# Altium schematic sheet SCH.SchDoc
size A2
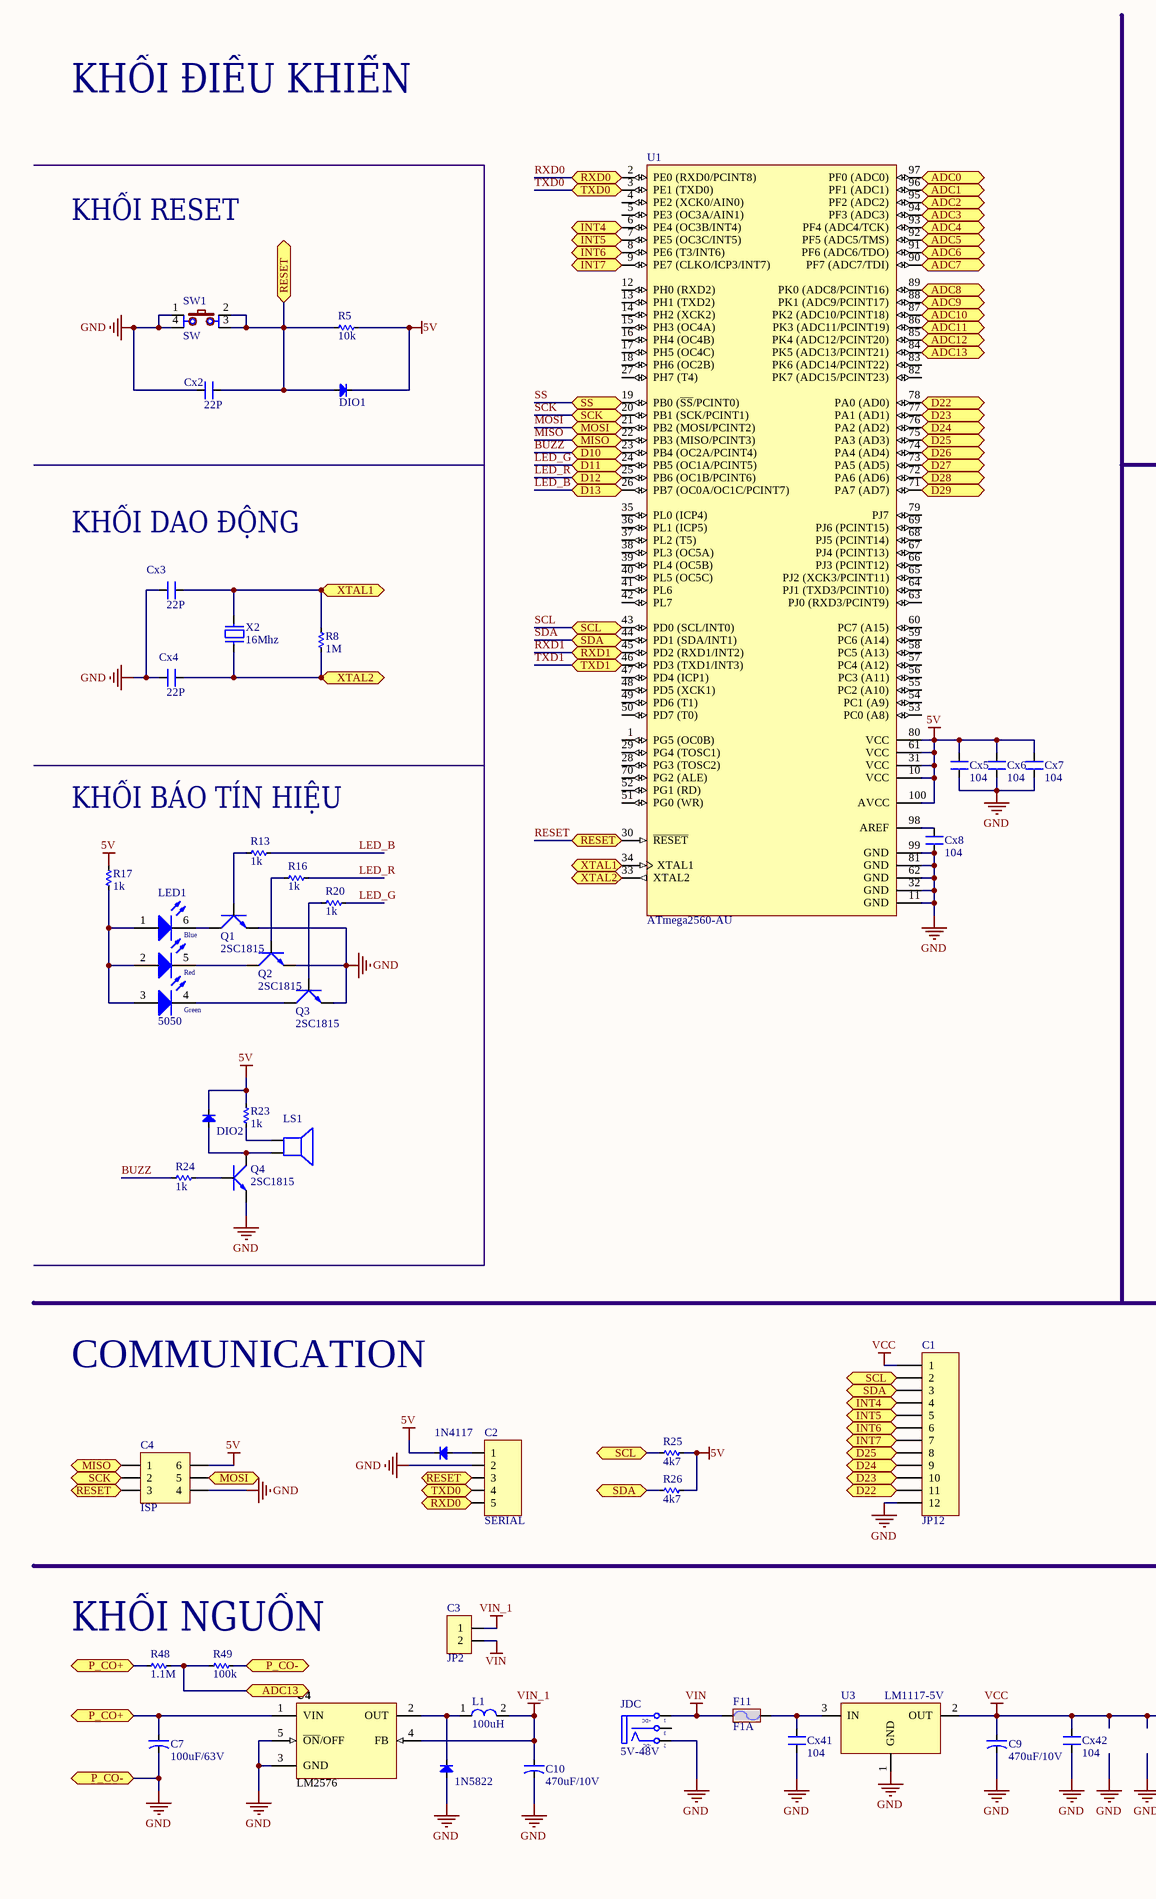
[diagram p0: SCH.SchDoc, left]
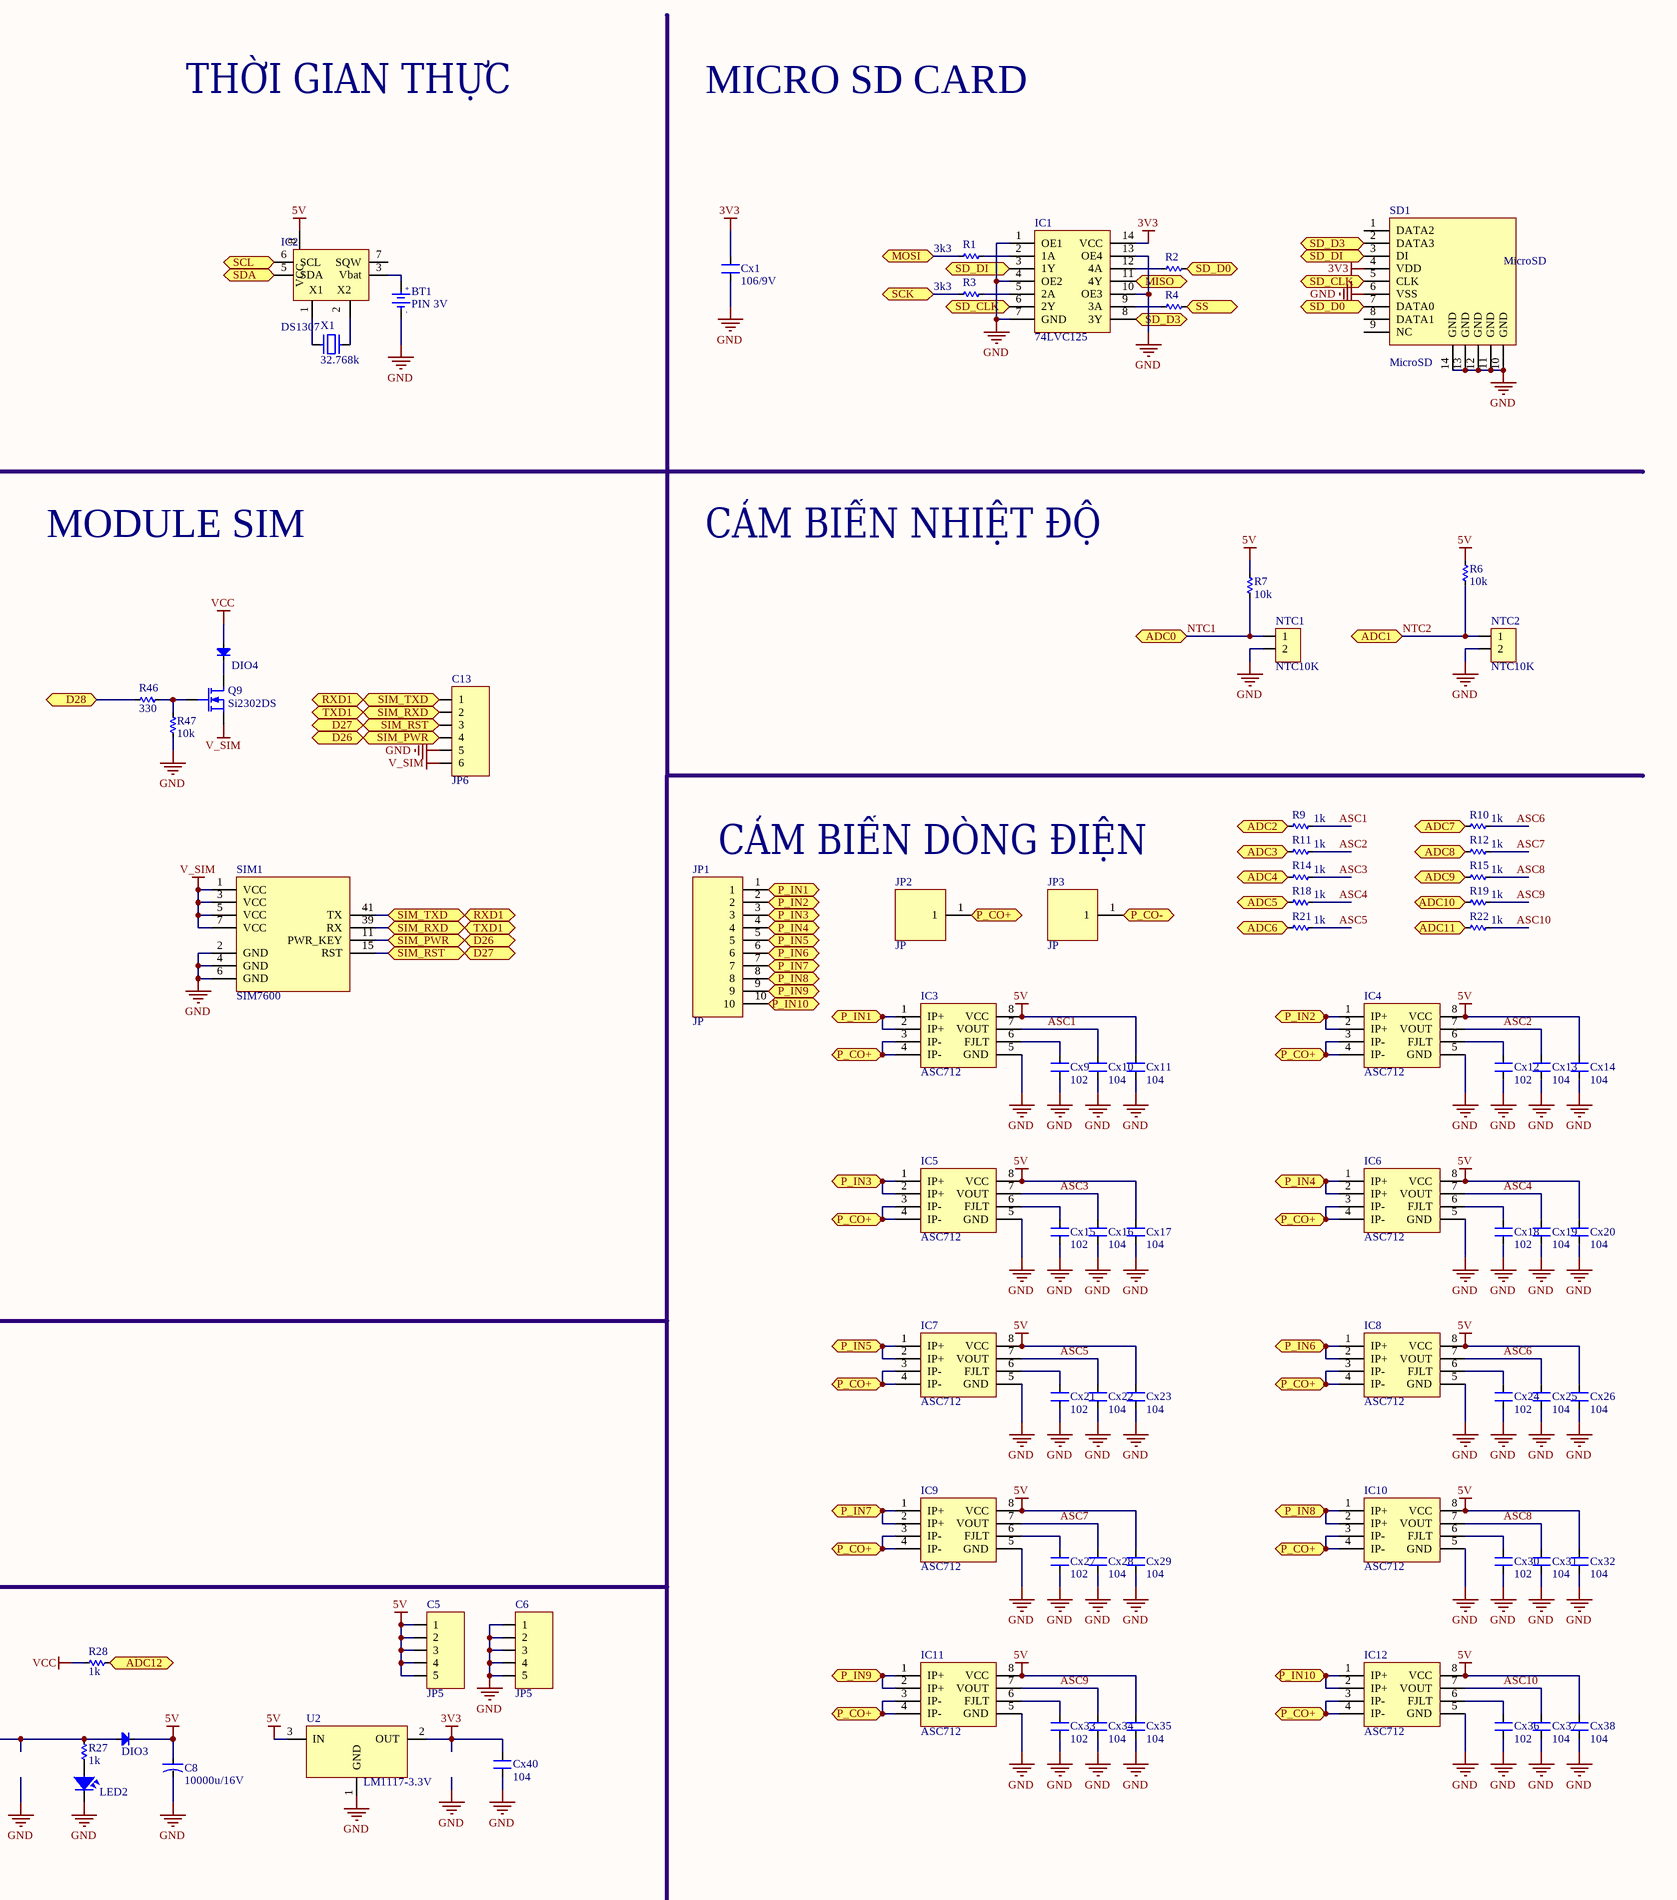
[diagram p1: SCH.SchDoc, right]

## Parts
1N4117  Diode SMD  [DIO-SMD-106]  (value not drawn)
1N5822  Diode SMD  [DIO-SMD-A]  (value not drawn)
BT1  PIN 3V  [PIN CR1220-DIP]
C1  JP12  [JP12-D1T]
C2  SERIAL  [JP5-D1T]
C3  JP2  [JP2-CLOSED]
C4  ISP  [JP3-D2T]
C5  JP5  [JP5-D1T]
C6  JP5  [JP5-D1T]
C7  100uF/63V  [CAP-ALU-SMD-C]
C8  10000u/16V  [CA-ALU-16]
C9  470uF/10V  [CAP-ALU-SMD-C]
C10  470uF/10V  [CAP-ALU-SMD-C]
C13  JP6  [JP6-C1T]
Cx1  106/9V  [CN-SMD-1206]
Cx2  22P  [CN-SMD-0805]
Cx3  22P  [CN-SMD-0805]
Cx4  22P  [CN-SMD-0805]
Cx5  104  [CN-SMD-0805]
Cx6  104  [CN-SMD-0805]
Cx7  104  [CN-SMD-0805]
Cx8  104  [CN-SMD-0805]
Cx9  102  [CN-SMD-0805]
Cx10  104  [CN-SMD-0805]
Cx11  104  [CN-SMD-0805]
Cx12  102  [CN-SMD-0805]
Cx13  104  [CN-SMD-0805]
Cx14  104  [CN-SMD-0805]
Cx15  102  [CN-SMD-0805]
Cx16  104  [CN-SMD-0805]
Cx17  104  [CN-SMD-0805]
Cx18  102  [CN-SMD-0805]
Cx19  104  [CN-SMD-0805]
Cx20  104  [CN-SMD-0805]
Cx21  102  [CN-SMD-0805]
Cx22  104  [CN-SMD-0805]
Cx23  104  [CN-SMD-0805]
Cx24  102  [CN-SMD-0805]
Cx25  104  [CN-SMD-0805]
Cx26  104  [CN-SMD-0805]
Cx27  102  [CN-SMD-0805]
Cx28  104  [CN-SMD-0805]
Cx29  104  [CN-SMD-0805]
Cx30  102  [CN-SMD-0805]
Cx31  104  [CN-SMD-0805]
Cx32  104  [CN-SMD-0805]
Cx33  102  [CN-SMD-0805]
Cx34  104  [CN-SMD-0805]
Cx35  104  [CN-SMD-0805]
Cx36  102  [CN-SMD-0805]
Cx37  104  [CN-SMD-0805]
Cx38  104  [CN-SMD-0805]
Cx40  104  [CN-SMD-0805]
Cx41  104  [CN-SMD-0805]
Cx42  104  [CN-SMD-0805]
DIO1  Diode SMD  [DIO-SMD-106]  (value not drawn)
DIO2  Diode SMD  [DIO-SMD-106]  (value not drawn)
DIO3  Diode SMD  [DIO-SMD-106]  (value not drawn)
DIO4  Diode SMD  [DIO-SMD-106]  (value not drawn)
F11  F1A  [Fuse5]
IC1  74LVC125  [74LVC125]
IC2  DS1307  [SO8]
IC3  ASC712  [ASC712]
IC4  ASC712  [ASC712]
IC5  ASC712  [ASC712]
IC6  ASC712  [ASC712]
IC7  ASC712  [ASC712]
IC8  ASC712  [ASC712]
IC9  ASC712  [ASC712]
IC10  ASC712  [ASC712]
IC11  ASC712  [ASC712]
IC12  ASC712  [ASC712]
JDC  5V-48V  [DC0]
JP1  JP  [JP10-LARGE]
JP2  JP  [JP1-LARGE]
JP3  JP  [JP1-LARGE]
L1  100uH  [L-SMD-M-12x10]
LED1  5050  [LED RGB 5050]
LED2  LED  [LED-0805-Red]  (value not drawn)
LS1  Speaker  [SPEAKER]  (value not drawn)
NTC1  NTC10K  [Header2]
NTC2  NTC10K  [Header2]
Q1  2SC1815  [SOT23-321]
Q2  2SC1815  [SOT23-321]
Q3  2SC1815  [SOT23-321]
Q4  2SC1815  [SOT23-321]
Q9  Si2302DS  [SOT23-132]
R1  3k3  [RES-SMD-0805]
R2  3k3  [RES-SMD-0805]  (value not drawn)
R3  3k3  [RES-SMD-0805]
R4  3k3  [RES-SMD-0805]  (value not drawn)
R5  10k  [RES-SMD-0805]
R6  10k  [RES-SMD-0805]
R7  10k  [RES-SMD-0805]
R8  1M  [RES-SMD-0805]
R9  1k  [RES-SMD-0805]
R10  1k  [RES-SMD-0805]
R11  1k  [RES-SMD-0805]
R12  1k  [RES-SMD-0805]
R13  1k  [RES-SMD-0805]
R14  1k  [RES-SMD-0805]
R15  1k  [RES-SMD-0805]
R16  1k  [RES-SMD-0805]
R17  1k  [RES-SMD-0805]
R18  1k  [RES-SMD-0805]
R19  1k  [RES-SMD-0805]
R20  1k  [RES-SMD-0805]
R21  1k  [RES-SMD-0805]
R22  1k  [RES-SMD-0805]
R23  1k  [RES-SMD-0805]
R24  1k  [RES-SMD-0805]
R25  4k7  [RES-SMD-0805]
R26  4k7  [RES-SMD-0805]
R27  1k  [RES-SMD-0805]
R28  1k  [RES-SMD-0805]
R46  330  [RES-SMD-0805]
R47  10k  [RES-SMD-0805]
R48  1.1M  [RES-SMD-0805]
R49  100k  [RES-SMD-0805]
SD1  MicroSD  [MicroSD]
SIM1  SIM7600  [SIM7600]
SW1  SW  [SW2-DIP]
U1  ATmega2560-AU  [TQFP100L]
U2  LM1117-3.3V  [SOT223]
U3  LM1117-5V  [SOT223]
U4  LM2576  [TO263]
X1  32.768k  [XT32k]
X2  16Mhz  [XT2]

## Ports
ADC0, ADC1, ADC2, ADC3, ADC4, ADC5, ADC6, ADC7, ADC8, ADC9, ADC10, ADC11, ADC12, ADC13, D10, D11, D12, D13, D22, D23, D24, D25, D26, D27, D28, D29, INT4, INT5, INT6, INT7, MISO, MOSI, P_CO+, P_CO-, P_IN1, P_IN2, P_IN3, P_IN4, P_IN5, P_IN6, P_IN7, P_IN8, P_IN9, P_IN10, RESET, RXD0, RXD1, SCK, SCL, SD_CLK, SD_D0, SD_D3, SD_DI, SDA, SIM_PWR, SIM_RST, SIM_RXD, SIM_TXD, SS, TXD0, TXD1, XTAL1, XTAL2

## Nets
3V3: Cx1.2 Cx40.2 IC1.14(VCC) SD1.4(VDD) U2.2(OUT)
5V: 1N4117.2(K) C4.6 C5.1 C5.2 C5.3 C5.4 C5.5 C8.1 Cx5.2 Cx6.2 Cx7.2 Cx11.2 Cx14.2 Cx17.2 Cx20.2 Cx23.2 Cx26.2 Cx29.2 Cx32.2 Cx35.2 Cx38.2 DIO1.2(K) DIO2.2(K) DIO3.2(K) IC2.8(VCC) IC3.8(VCC) IC4.8(VCC) IC5.8(VCC) IC6.8(VCC) IC7.8(VCC) IC8.8(VCC) IC9.8(VCC) IC10.8(VCC) IC11.8(VCC) IC12.8(VCC) R5.1 R6.1 R7.1 R17.1 R23.1 R25.1 R26.1 U1.10(VCC) U1.31(VCC) U1.61(VCC) U1.80(VCC) U1.100(AVCC) U2.3(IN)
GND: 1N5822.1(A) BT1.2(GND) C1.12 C2.2 C4.4 C6.1 C6.2 C6.3 C6.4 C6.5 C7.2 C8.2 C9.2 C10.2 C13.5 Cx1.1 Cx2.1 Cx3.1 Cx4.1 Cx5.1 Cx6.1 Cx7.1 Cx8.1 Cx9.1 Cx10.1 Cx11.1 Cx12.1 Cx13.1 Cx14.1 Cx15.1 Cx16.1 Cx17.1 Cx18.1 Cx19.1 Cx20.1 Cx21.1 Cx22.1 Cx23.1 Cx24.1 Cx25.1 Cx26.1 Cx27.1 Cx28.1 Cx29.1 Cx30.1 Cx31.1 Cx32.1 Cx33.1 Cx34.1 Cx35.1 Cx36.1 Cx37.1 Cx38.1 Cx40.1 Cx41.1 Cx42.1 IC1.1(OE1) IC1.4(OE2) IC1.7(GND) IC1.10(OE3) IC1.13(OE4) IC2.4(GND) IC3.5(GND) IC4.5(GND) IC5.5(GND) IC6.5(GND) IC7.5(GND) IC8.5(GND) IC9.5(GND) IC10.5(GND) IC11.5(GND) IC12.5(GND) JDC.2(TN) JP3.1 LED2.2 NTC1.2 NTC2.2 Q1.1(E) Q2.1(E) Q3.1(E) Q4.1(E) R47.2 R49.2 SD1.6(VSS) SD1.10(GND) SD1.11(GND) SD1.12(GND) SD1.13(GND) SD1.14(GND) SIM1.2(GND) SIM1.4(GND) SIM1.6(GND) SW1.1 SW1.4 U1.11(GND) U1.32(GND) U1.62(GND) U1.81(GND) U1.99(GND) U2.1(GND) U3.1(GND) U4.3(GND) U4.5(~{ON}/OFF) ; port P_CO-
V_SIM: C13.6 Q9.2(S) SIM1.1(VCC) SIM1.3(VCC) SIM1.5(VCC) SIM1.7(VCC)
VCC: C1.1 C9.1 Cx42.2 DIO3.1(A) DIO4.1(A) R27.2 R28.1 U3.2(OUT)
VIN: C3.2 F11.1 JDC.1(T)
VIN_1: C3.1 C10.1 L1.2 U4.4(FB)
ADC2: R9.2 U1.95(PF2_(ADC2)) ; port ADC2
ADC3: R11.2 U1.94(PF3_(ADC3)) ; port ADC3
ADC4: R14.2 U1.93(PF4_(ADC4/TCK)) ; port ADC4
ADC5: R18.2 U1.92(PF5_(ADC5/TMS)) ; port ADC5
ADC6: R21.2 U1.91(PF6_(ADC6/TDO)) ; port ADC6
ADC7: R10.2 U1.90(PF7_(ADC7/TDI)) ; port ADC7
ADC8: R12.2 U1.89(PK0_(ADC8/PCINT16)) ; port ADC8
ADC9: R15.2 U1.88(PK1_(ADC9/PCINT17)) ; port ADC9
ADC10: R19.2 U1.87(PK2_(ADC10/PCINT18)) ; port ADC10
ADC11: R22.2 U1.86(PK3_(ADC11/PCINT19)) ; port ADC11
ADC12: R28.2 U1.85(PK4_(ADC12/PCINT20)) ; port ADC12
ADC13: R48.2 R49.1 U1.84(PK5_(ADC13/PCINT21)) ; port ADC13
ASC1: Cx10.2 IC3.7(VOUT) R9.1
ASC2: Cx13.2 IC4.7(VOUT) R11.1
ASC3: Cx16.2 IC5.7(VOUT) R14.1
ASC4: Cx19.2 IC6.7(VOUT) R18.1
ASC5: Cx22.2 IC7.7(VOUT) R21.1
ASC6: Cx25.2 IC8.7(VOUT) R10.1
ASC7: Cx28.2 IC9.7(VOUT) R12.1
ASC8: Cx31.2 IC10.7(VOUT) R15.1
ASC9: Cx34.2 IC11.7(VOUT) R19.1
ASC10: Cx37.2 IC12.7(VOUT) R22.1
BUZZ: R24.1 U1.23(PB4_(OC2A/PCINT4)) ; port D10
D22: C1.11 U1.78(PA0_(AD0)) ; port D22
D23: C1.10 U1.77(PA1_(AD1)) ; port D23
D24: C1.9 U1.76(PA2_(AD2)) ; port D24
D25: C1.8 U1.75(PA3_(AD3)) ; port D25
D26: C13.4 SIM1.11(PWR_KEY) U1.74(PA4_(AD4)) ; port D26, port SIM_PWR
D27: C13.3 SIM1.15(RST) U1.73(PA5_(AD5)) ; port D27, port SIM_RST
D28: R46.2 U1.72(PA6_(AD6)) ; port D28
D29: U1.71(PA7_(AD7)) ; port D29
INT4: C1.4 U1.6(PE4_(OC3B/INT4)) ; port INT4
INT5: C1.5 U1.7(PE5_(OC3C/INT5)) ; port INT5
INT6: C1.6 U1.8(PE6_(T3/INT6)) ; port INT6
INT7: C1.7 U1.9(PE7_(CLKO/ICP3/INT7)) ; port INT7
LED_B: R13.1 U1.26(PB7_(OC0A/OC1C/PCINT7)) ; port D13
LED_G: R20.1 U1.24(PB5_(OC1A/PCINT5)) ; port D11
LED_R: R16.1 U1.25(PB6_(OC1B/PCINT6)) ; port D12
MISO: C4.1 IC1.11(4Y) U1.22(PB3_(MISO/PCINT3)) ; port MISO
MOSI: C4.5 R1.2 U1.21(PB2_(MOSI/PCINT2)) ; port MOSI
NTC1: NTC1.1 R7.2 U1.97(PF0_(ADC0)) ; port ADC0
NTC2: NTC2.1 R6.2 U1.96(PF1_(ADC1)) ; port ADC1
P_CO+: C7.1 IC3.3(IP-) IC3.4(IP-) IC4.3(IP-) IC4.4(IP-) IC5.3(IP-) IC5.4(IP-) IC6.3(IP-) IC6.4(IP-) IC7.3(IP-) IC7.4(IP-) IC8.3(IP-) IC8.4(IP-) IC9.3(IP-) IC9.4(IP-) IC10.3(IP-) IC10.4(IP-) IC11.3(IP-) IC11.4(IP-) IC12.3(IP-) IC12.4(IP-) JP2.1 R48.1 U4.1(VIN) ; port P_CO+
P_IN1: IC3.1(IP+) IC3.2(IP+) JP1.1 ; port P_IN1
P_IN2: IC4.1(IP+) IC4.2(IP+) JP1.2 ; port P_IN2
P_IN3: IC5.1(IP+) IC5.2(IP+) JP1.3 ; port P_IN3
P_IN4: IC6.1(IP+) IC6.2(IP+) JP1.4 ; port P_IN4
P_IN5: IC7.1(IP+) IC7.2(IP+) JP1.5 ; port P_IN5
P_IN6: IC8.1(IP+) IC8.2(IP+) JP1.6 ; port P_IN6
P_IN7: IC9.1(IP+) IC9.2(IP+) JP1.7 ; port P_IN7
P_IN8: IC10.1(IP+) IC10.2(IP+) JP1.8 ; port P_IN8
P_IN9: IC11.1(IP+) IC11.2(IP+) JP1.9 ; port P_IN9
P_IN10: IC12.1(IP+) IC12.2(IP+) JP1.10 ; port P_IN10
RESET: C2.3 C4.3 Cx2.2 DIO1.1(A) R5.2 SW1.2 SW1.3 U1.30(~{RESET}) ; port RESET
RXD0: C2.5 U1.2(PE0_(RXD0/PCINT8)) ; port RXD0
RXD1: C13.1 SIM1.41(TX) U1.45(PD2_(RXD1/INT2)) ; port RXD1, port SIM_TXD
SCK: C4.2 R3.2 U1.20(PB1_(SCK/PCINT1)) ; port SCK
SCL: C1.2 IC2.6(SCL) R25.2 U1.43(PD0_(SCL/INT0)) ; port SCL
SD_CLK: IC1.6(2Y) SD1.5(CLK) ; port SD_CLK
SD_D0: R2.1 SD1.7(DATA0) ; port SD_D0
SD_D3: IC1.8(3Y) SD1.2(DATA3) ; port SD_D3
SD_DI: IC1.3(1Y) SD1.3(DI) ; port SD_DI
SDA: C1.3 IC2.5(SDA) R26.2 U1.44(PD1_(SDA/INT1)) ; port SDA
SS: R4.1 U1.19(PB0_(~{SS}/PCINT0)) ; port SS
TXD0: C2.4 U1.3(PE1_(TXD0)) ; port TXD0
TXD1: C13.2 SIM1.39(RX) U1.46(PD3_(TXD1/INT3)) ; port TXD1, port SIM_RXD
XTAL1: Cx3.2 R8.1 U1.34(XTAL1) X2.2 ; port XTAL1
XTAL2: Cx4.2 R8.2 U1.33(XTAL2) X2.1 ; port XTAL2
Net1N4117_1: 1N4117.1(A) C2.1
Net1N5822_2: 1N5822.2(K) L1.1 U4.2(OUT)
NetBT1_1: BT1.1(+3V) IC2.3(Vbat)
NetCx8_2: Cx8.2 U1.98(AREF)
NetCx9_2: Cx9.2 IC3.6(FJLT)
NetCx12_2: Cx12.2 IC4.6(FJLT)
NetCx15_2: Cx15.2 IC5.6(FJLT)
NetCx18_2: Cx18.2 IC6.6(FJLT)
NetCx21_2: Cx21.2 IC7.6(FJLT)
NetCx24_2: Cx24.2 IC8.6(FJLT)
NetCx27_2: Cx27.2 IC9.6(FJLT)
NetCx30_2: Cx30.2 IC10.6(FJLT)
NetCx33_2: Cx33.2 IC11.6(FJLT)
NetCx36_2: Cx36.2 IC12.6(FJLT)
NetCx41_2: Cx41.2 F11.2 U3.3(IN)
NetDIO2_1: DIO2.1(A) LS1.2 Q4.2(C)
NetDIO4_2: DIO4.2(K) Q9.3(D)
NetIC1_2: IC1.2(1A) R1.1
NetIC1_5: IC1.5(2A) R3.1
NetIC1_9: IC1.9(3A) R4.2
NetIC1_12: IC1.12(4A) R2.2
NetIC2_1: IC2.1(X1) X1.2
NetIC2_2: IC2.2(X2) X1.1
NetLED1_1: LED1.1 LED1.2 LED1.3 R17.2
NetLED1_4: LED1.4 Q3.2(C)
NetLED1_5: LED1.5 Q2.2(C)
NetLED1_6: LED1.6 Q1.2(C)
NetLED2_1: LED2.1 R27.1
NetLS1_1: LS1.1 R23.2
NetQ1_3: Q1.3(B) R13.2
NetQ2_3: Q2.3(B) R16.2
NetQ3_3: Q3.3(B) R20.2
NetQ4_3: Q4.3(B) R24.2
NetQ9_1: Q9.1(G) R46.1 R47.1

Not connected (* = marked no-connect by the designer): IC2 7(SQW); JDC 3(S); SD1 1(DATA2) 8(DATA1) 9(NC); U1 1(PG5_(OC0B)) 4(PE2_(XCK0/AIN0)) 5(PE3_(OC3A/AIN1)) 12(PH0_(RXD2)) 13(PH1_(TXD2)) 14(PH2_(XCK2)) 15(PH3_(OC4A)) 16(PH4_(OC4B)) 17(PH5_(OC4C)) 18(PH6_(OC2B)) 27(PH7_(T4)) 28(PG3_(TOSC2)) 29(PG4_(TOSC1)) 35(PL0_(ICP4)) 36(PL1_(ICP5)) 37(PL2_(T5)) 38(PL3_(OC5A)) 39(PL4_(OC5B)) 40(PL5_(OC5C)) 41(PL6) 42(PL7) 47(PD4_(ICP1)) 48(PD5_(XCK1)) 49(PD6_(T1)) 50(PD7_(T0)) 51(PG0_(WR)) 52(PG1_(RD)) 53(PC0_(A8)) 54(PC1_(A9)) 55(PC2_(A10)) 56(PC3_(A11)) 57(PC4_(A12)) 58(PC5_(A13)) 59(PC6_(A14)) 60(PC7_(A15)) 63(PJ0_(RXD3/PCINT9)) 64(PJ1_(TXD3/PCINT10)) 65(PJ2_(XCK3/PCINT11)) 66(PJ3_(PCINT12)) 67(PJ4_(PCINT13)) 68(PJ5_(PCINT14)) 69(PJ6_(PCINT15)) 70(PG2_(ALE)) 79(PJ7) 82(PK7_(ADC15/PCINT23)) 83(PK6_(ADC14/PCINT22))

## Notes on the sheet
- KHỐI ĐIỀU KHIỂN
- THỜI GIAN THỰC
- MICRO SD CARD
- KHỐI RESET
- KHỐI DAO ĐỘNG
- MODULE SIM
- CẢM BIẾN NHIỆT ĐỘ
- KHỐI BÁO TÍN HIỆU
- (near JP1) CẢM BIẾN DÒNG ĐIỆN
- COMMUNICATION
- KHỐI NGUỒN
- (in symbol DCIN) +DC; -DC
- (in symbol LED RGB 5050) Blue; Red; Green
- (in symbol PIN 3V) +; -

## Library data of the parts
1N4117 1N5822 DIO1-DIO4 = Diode SMD: Default Diode; Code - JEDEC: DO-214-AB; Value: 1N5007; Published: 8-Jun-2000; Revision: July-2002: Re-released for DXP Platform.; Publisher: Altium Limited
BT1 = PIN 3V: Battery 3VDC; Value: PIN 3V
C1 = JP12: WR-PHD 2.54 mm Angled Socket Header; Manufacturer: W¨¹rth Elektronik eiSos GmbH; partNo: 613012143121; ComponentLink1 Description: Manufacturer; ComponentLink2 Description: Datasheet; NoPins: 12; Created Date: 29 March 2013; ComponentLink1URL: http://www.we-online.com; ComponentLink2URL: http://katalog.we-online.de/em/datasheet/6130xx143121.pdf; Created by: Karrer Zheng
C2 C5 C6 = JP5: WR-PHD 2.54 mm Angled Socket Header; Manufacturer: W¨¹rth Elektronik eiSos GmbH; partNo: 613005143121; ComponentLink1 Description: Manufacturer; ComponentLink2 Description: Datasheet; NoPins: 05; Created Date: 29 March 2013; ComponentLink1URL: http://www.we-online.com; ComponentLink2URL: http://katalog.we-online.de/em/datasheet/6130xx143121.pdf; Created by: Karrer Zheng
C3 = JP2: WR-PHD 2.54 mm Angled Socket Header; Manufacturer: W¨¹rth Elektronik eiSos GmbH; partNo: 613002143121; ComponentLink1 Description: Manufacturer; ComponentLink2 Description: Datasheet; NoPins: 02; Created Date: 29 March 2013; ComponentLink1URL: http://www.we-online.com; ComponentLink2URL: http://katalog.we-online.de/em/datasheet/6130xx143121.pdf; Created by: Karrer Zheng
C4 = JP3x2: WR-PHD 2.54 mm Dual Socket Header; Manufacturer: W¨¹rth Elektronik eiSos GmbH; partNo: 61300621821; ComponentLink1 Description: Manufacturer; ComponentLink2 Description: Datasheet; NoPins: 06; Created Date: 29 March 2013; ComponentLink1URL: http://www.we-online.com; ComponentLink2URL: http://katalog.we-online.de/em/datasheet/6130xx21821.pdf; Created by: Karrer Zheng
C7 C9 C10 = CN-ALU-SMD: Polarized Capacitor (Axial); Published: 8-Jun-2000; LatestRevisionDate: 17-Jul-2002; LatestRevisionNote: Re-released for DXP Platform.; PackageReference: POLAR0.8; Publisher: Altium Limited
C8 = CN-ALU-DIP: Capacitor (Semiconductor SIM Model); Value: 104; LatestRevisionDate: 17-Jul-2002; LatestRevisionNote: Re-released for DXP Platform.; PackageReference: C1206; Publisher: Altium Limited
C13 = JP6: WR-PHD 2.54 mm Angled Socket Header; Manufacturer: W¨¹rth Elektronik eiSos GmbH; partNo: 613006143121; ComponentLink1 Description: Manufacturer; ComponentLink2 Description: Datasheet; NoPins: 06; Created Date: 29 March 2013; ComponentLink1URL: http://www.we-online.com; ComponentLink2URL: http://katalog.we-online.de/em/datasheet/6130xx143121.pdf; Created by: Karrer Zheng
Cx1-Cx38 Cx40-Cx42 = CN: Value: 33pF
F11 = Fuse: Designed by: VanDungEvn; Value: Fuse
IC2 = DS1307: Real Timer Serial; Value: DS1307
JDC = DCIN: Jac DC input; Value: Jac DC
JP1 = JP10-LARGE
JP2 JP3 = JP1-LARGE
L1 = L-SMD-1: partNo: 78477010; Manufacturer: Wurth Elektronik; Inductance: 1.0 μH; ComponentLink1Description: Manufacturer; ComponentLink1URL: http://www.we-online.de; Created by: Baojun Chen; Created Date: Nov.2015; ComponentLink2Description: Datasheet; ComponentLink2URL: http://katalog.we-online.de/pbs/datasheet/78477010.pdf
LED1 = LED RGB 5050: PartNo: 150141M173100; Manufacturer: Würth Elektronik eiSos GmbH; Color: Red & Green & Blue; ComponentLink1Description: Manufacturer; ComponentLink1URL: http://www.we-online.de; Created by: Christin Otto; Created Date: June 2013; ComponentLink2Description: Datasheet; ComponentLink2URL: http://katalog.we-online.com/led/datasheet/150141M173100.pdf
LED2 = LED SMD: Value: LED 3 - 5 ly 2 Colour
LS1 = Speaker: Loudspeaker; Published: 24-Mar-1999; LatestRevisionDate: 17-Jul-2002; LatestRevisionNote: Re-released for DXP Platform.; PackageReference: PIN2; Publisher: Altium Limited
NTC1 NTC2 = Header2: Header IDC, 2 x 1 Pin Vertical 2.54mm Pitch (Non-Boxed, Male); Manufacturer: W¨¹rth Elektronik eiSos GmbH; partNo: 613002143121; ComponentLink1 Description: Manufacturer; ComponentLink2 Description: Datasheet; NoPins: 02; Created Date: 29 March 2013; ComponentLink1URL: http://www.we-online.com; ComponentLink2URL: http://katalog.we-online.de/em/datasheet/6130xx143121.pdf; Created by: Karrer Zheng
Q1-Q4 = 2SC1815: NPN 600mW, ECB; Value: C1815
Q9 = Si2302DS: N-Channel MOSFET; Published: 8-Jun-2000; LatestRevisionDate: 17-Jul-2002; LatestRevisionNote: Re-released for DXP Platform.; PackageVersion: 1995/1996; PackageReference: E3; Publisher: Altium Limited; PackageDescription: TO, Flat Index; 3 In-Line, Axial Leads; Body Dia. 4.6mm; Lead Dia. 0.5 mm (max)
R1-R28 R46-R49 = Res-SMD: Resistor; Manufacturer: Generic Components; Class: Passive; Published: 08/06/2000; Publisher: Altium Hobart Technology Centre
SIM1 = Module - SIM7600
SW1 = SW4: Switch button 4 pin; Value: Button chip 4 pin
U1 = ATmega2560-AU: 8-bit AVR Microcontroller, 4.5-5.5V, 256KB Flash, 4KB EEPROM, 8KB SRAM, 86 GPIO pins, 100-pin TQFP, Industrial Grade (-40°C to 85°C), Pb-Free; Supplier 1: Digi-Key; Supplier Part Number 1: ATMEGA2560-16AUR-ND
U2 U3 = LM1117: 800mA Low-Dropout Linear Regulator; Creator: Nguyen Ba Bien; Website: http://group3i.net
U4 = LM2576: Max Input Voltage: 12 V; Max Output Current: 3 (6.0 peak) A; Max Output Voltage: mV; Category: IC-Power; Min Input Voltage: mV; Min Output Voltage: mV; Mounting Technology: Surface Mount; Status: Unreleased; Supply Voltage: mV; Temperature Range: -40 to +125 degC
X1 X2 = XT2: Crystal, 32.768 KHz, -40 to 85 degC, 3.2 x 1.5 x 0.9 mm SMD; Value: 4Mhz